# Altium schematic sheet ESP.SchDoc
size A4; SheetNumber: 5; SheetTotal: 6
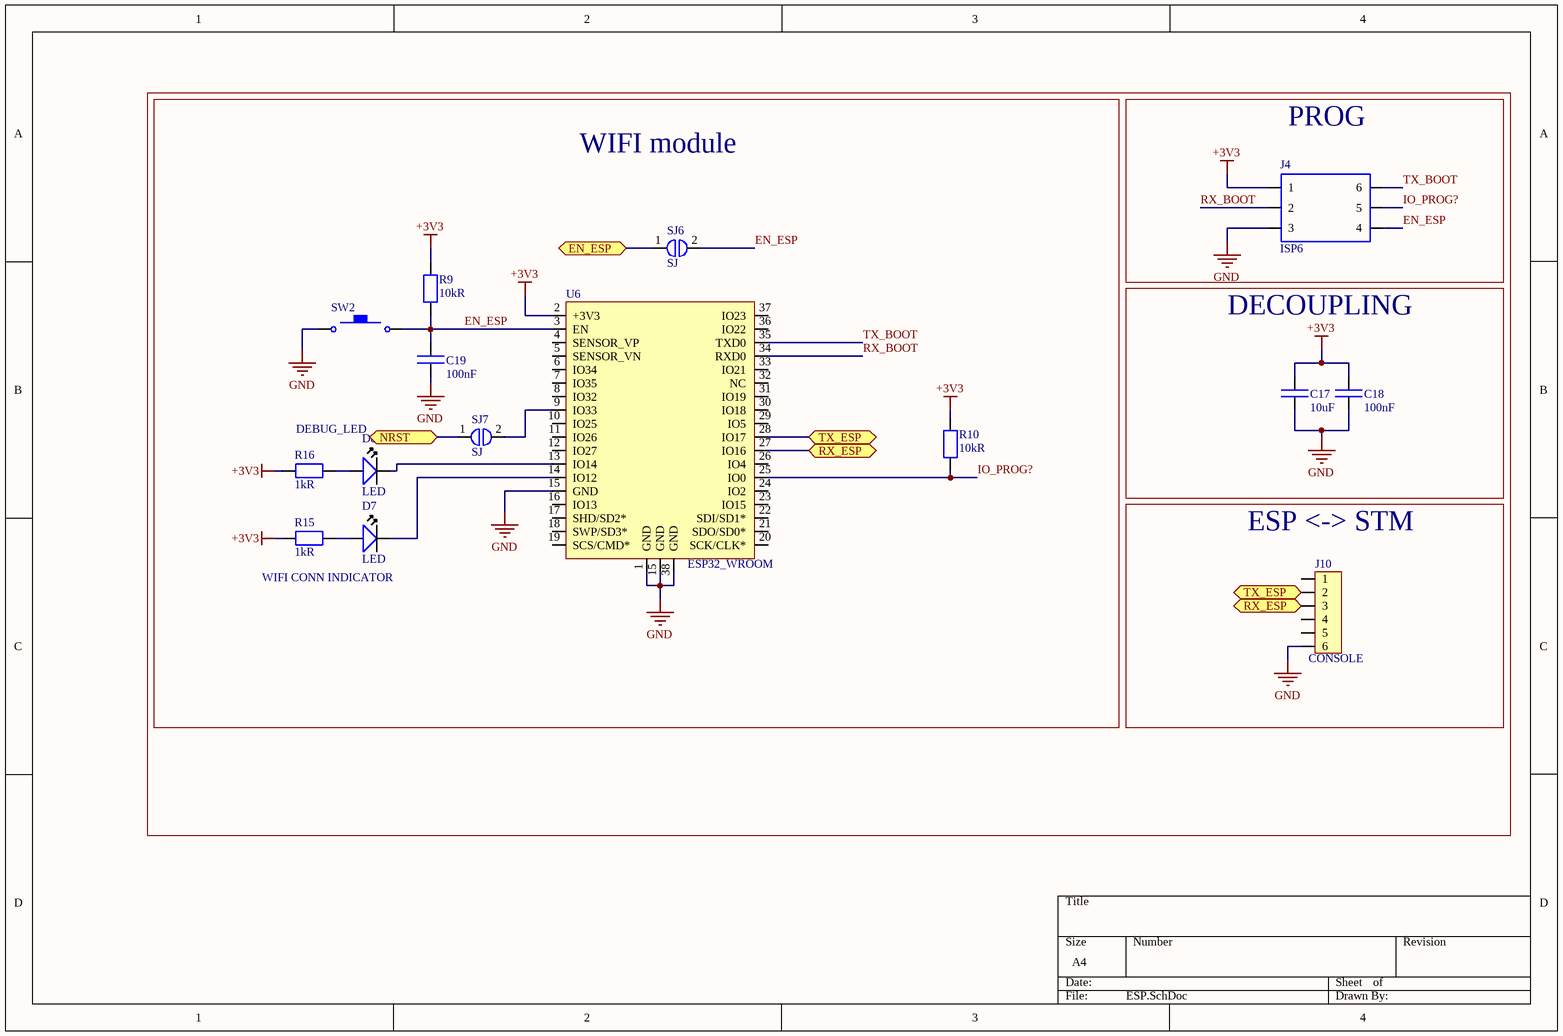
[diagram p0: ESP.SchDoc]

## Parts
C17  10uF  [C0805]
C18  100nF  [C0603]
C19  100nF  [C0603]
D7  LED  [LED0805]
D8  LED  [LED0805]
J4  ISP6  [ISP-6]
J10  CONSOLE  [pin_header_6_male]
R9  10kR  [R0603]
R10  10kR  [R0603]
R15  1kR  [R0603]
R16  1kR  [R0603]
SJ6  SJ  [SJ]
SJ7  SJ  [SJ]
SW2  tactile_switch  [tact_sw_3mmx4mm]  (value not drawn)
U6  ESP32_WROOM  [ESP32-WROOM-32]

## Blocks framed on the sheet
WIFI module: C19 D7 D8 R9 R10 R15 R16 SJ6 SJ7 SW2 U6
PROG: J4
DECOUPLING: C17 C18
ESP <-> STM: J10

## Ports
EN_ESP (bidir), NRST (bidir), RX_ESP (bidir), TX_ESP (bidir)

## Nets
+3V3: C17.1 C18.1 J4.1 R9.2 R10.2 R15.2 R16.2 U6.2(+3V3)
GND: C17.2 C18.2 C19.2 J4.3 J10.6 SW2.1 U6.1(GND) U6.15(GND) U6.38(GND)
EN_ESP: C19.1 J4.4 R9.1 SJ6.2 SW2.3 U6.3(EN)
EN_ESP: SJ6.1 ; port EN_ESP  [a separate net that carries the same name]
IO_PROG?: J4.5 R10.1 U6.25(IO0)
NRST: SJ7.1 ; port NRST
RX_BOOT: J4.2 U6.34(RXD0)
RX_ESP: J10.3 U6.27(IO16) ; port RX_ESP
TX_BOOT: J4.6 U6.35(TXD0)
TX_ESP: J10.2 U6.28(IO17) ; port TX_ESP
NetD7_A: D7.A R15.1
NetD7_K: D7.K U6.14(IO12)
NetD8_A: D8.A R16.1
NetD8_K: D8.K U6.13(IO14)
NetSJ7_2: SJ7.2 U6.9(IO33)

Not connected (* = marked no-connect by the designer): J10 1 4 5; U6 4(SENSOR_VP) 5(SENSOR_VN) 6(IO34) 7(IO35) 8(IO32) 10(IO25) 11(IO26) 12(IO27) 16(IO13) 17(SHD/SD2*) 18(SWP/SD3*) 19(SCS/CMD*) 20(SCK/CLK*) 21(SDO/SD0*) 22(SDI/SD1*) 23(IO15) 24(IO2) 26(IO4) 29(IO5) 30(IO18) 31(IO19) 32(NC) 33(IO21) 36(IO22) 37(IO23)

## Notes on the sheet
- DEBUG_LED
- WIFI CONN INDICATOR

## Library data of the parts
C17-C19 = Cap_SMD
J10 = GOLDPIN_6
R9 R10 R15 R16 = Res
U6 = ESP32_WROOM: pin to pad: 38>38+39